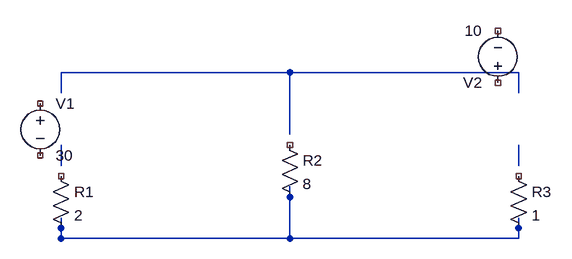
[diagram p0: schematic 04_cicuit.asc]
04_cicuit.asc, the LTspice schematic file:
Version 4
SHEET 1 1135 800
SYMBOL voltage 192 240 R0
WINDOW 0 24 16 Left 2
WINDOW 3 24 96 Left 2
SYMATTR InstName V1
SYMATTR Value 30
SYMBOL res 208 352 R0
WINDOW 0 36 40 Left 2
WINDOW 3 36 76 Left 2
SYMATTR InstName R1
SYMATTR Value 2
SYMBOL res 560 304 R0
WINDOW 0 36 40 Left 2
WINDOW 3 36 76 Left 2
SYMATTR InstName R2
SYMATTR Value 8
SYMBOL res 912 352 R0
WINDOW 0 36 40 Left 2
WINDOW 3 36 76 Left 2
SYMATTR InstName R3
SYMATTR Value 1
SYMBOL voltage 896 240 R180
WINDOW 0 24 16 Left 2
WINDOW 3 24 96 Left 2
SYMATTR InstName V2
SYMATTR Value 10
WIRE 576 208 576 304
WIRE 224 464 576 464
WIRE 576 464 576 384
WIRE 224 464 928 464
WIRE 928 240 928 208
WIRE 928 208 576 208
WIRE 928 320 928 336
WIRE 928 336 928 352
WIRE 928 432 928 448
WIRE 928 448 928 464
WIRE 224 240 224 208
WIRE 224 208 576 208
WIRE 224 320 224 352
WIRE 224 448 224 432
WIRE 224 432 224 448
WIRE 224 448 224 464

The netlist it stands for:
* 04_cicuit.asc
V1 NC_01 NC_02 30
R1 NC_03 N002 2
R2 NC_04 N002 8
R3 NC_05 N002 1
V2 NC_06 NC_07 10
.backanno
.end